# Altium schematic sheet Master_SCH.SchDoc: Блок контроля
size 420 x 297 mm; ApprovedBy: Мешков; CheckedBy: Черноскутов; Author: Самойлов; CompanyName: РГППУ; Title2str: токов; DecimalNumber: АБВГ.123456.001 33
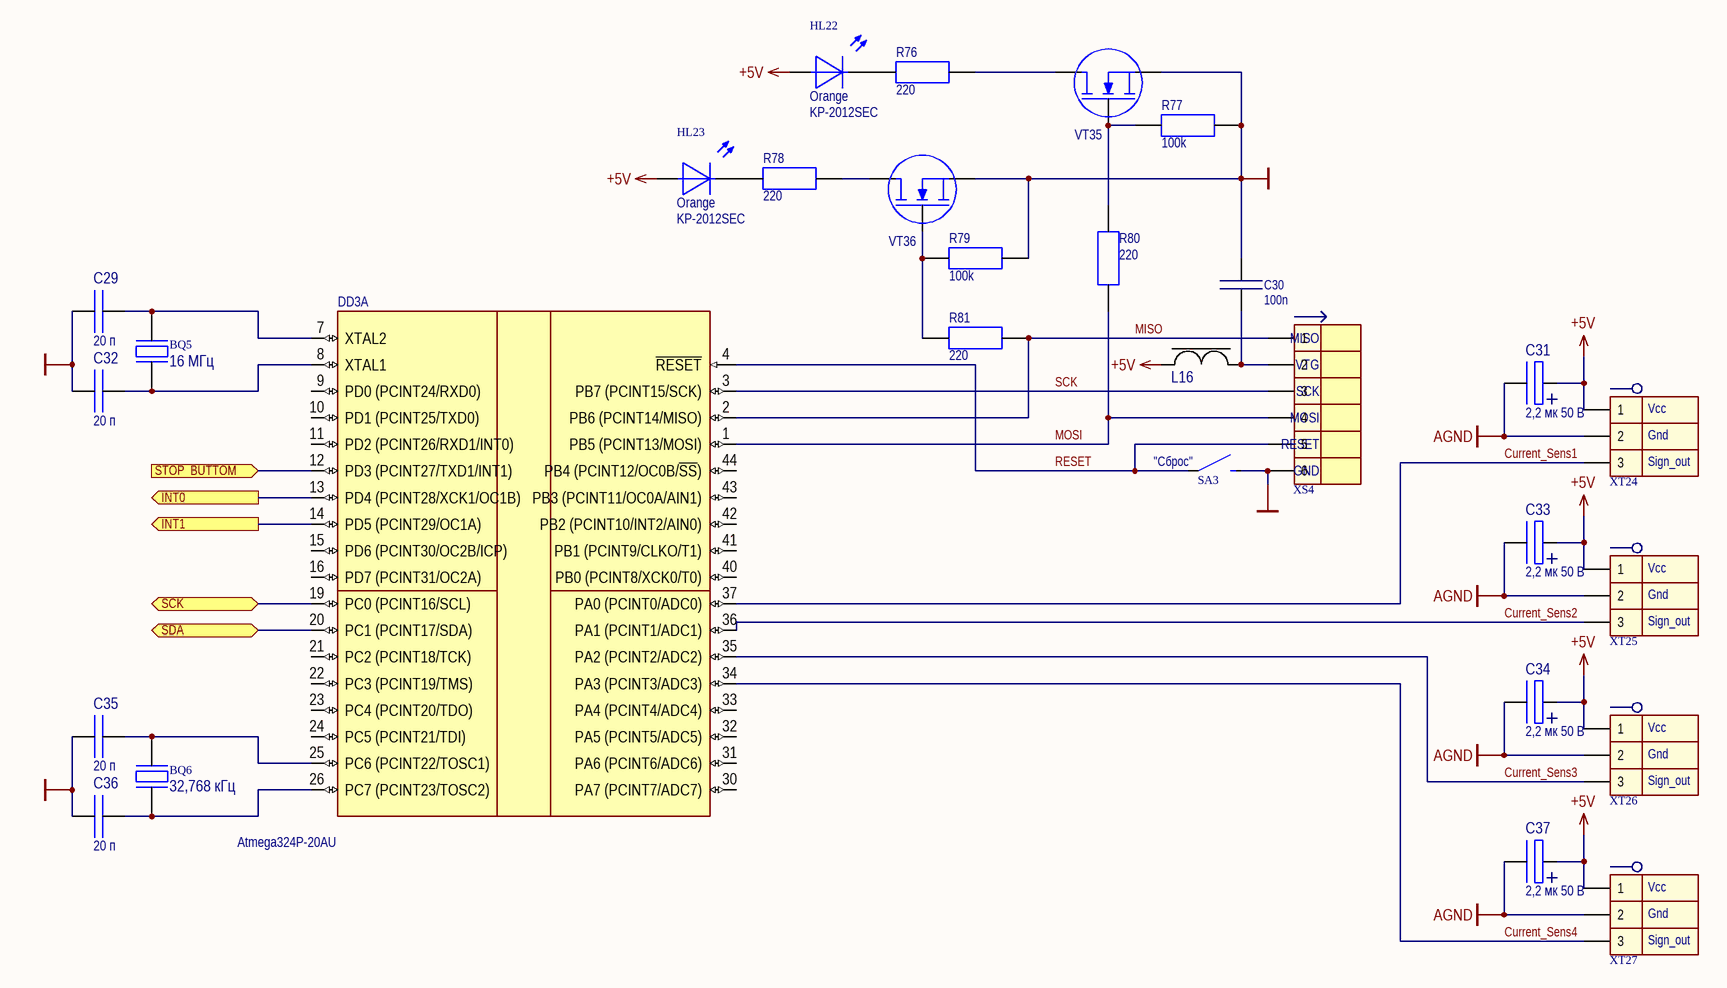
[diagram p0: Master_SCH.SchDoc]

## Parts
BQ5  16 МГц  [HC-49/S]
BQ6  32,768 кГц  [HC-49/S]
C29  value 20 п  [CAPC3216X05M]  (hidden comment: CC0603JRNP09BN200)
C30  100n  [SMDRC0805]
C31  value 2,2 мк 50 В  [CAP_POLAR_ELLYTE_B]  (hidden comment: CA050M2R20REB-0405)
C32  value 20 п  [CAPC3216X05M]  (hidden comment: CC0603JRNP09BN200)
C33  value 2,2 мк 50 В  [CAP_POLAR_ELLYTE_B]  (hidden comment: CA050M2R20REB-0405)
C34  value 2,2 мк 50 В  [CAP_POLAR_ELLYTE_B]  (hidden comment: CA050M2R20REB-0405)
C35  value 20 п  [CAPC3216X05M]  (hidden comment: CC0603JRNP09BN200)
C36  value 20 п  [CAPC3216X05M]  (hidden comment: CC0603JRNP09BN200)
C37  value 2,2 мк 50 В  [CAP_POLAR_ELLYTE_B]  (hidden comment: CA050M2R20REB-0405)
DD3  Atmega324P-20AU  [44ML_M]  (part A of 2)
HL22  Orange  ManufacturerPartNumber: KP-2012SEC  [DIOMELF2012M]
HL23  Orange  ManufacturerPartNumber: KP-2012SEC  [DIOMELF2012M]
L16  MPZ1608S181A  [INDC0603X03M]  (value not drawn)
R76  220  [SMDRC0805]
R77  100k  [SMDRC0805]
R78  220  [SMDRC0805]
R79  100k  [SMDRC0805]
R80  220  [SMDRC0805]
R81  220  [SMDRC0805]
SA3  DTSM20-4.3  [DTSM20]  (value not drawn)
VT35  2N7002  [SOT23 (TO-236AB)]  (value not drawn)
VT36  2N7002  [SOT23 (TO-236AB)]  (value not drawn)
XS4  IDC-06M  [IDC-06M]  (value not drawn)
XT24  330-031-12  [330-031-12]  (value not drawn)
XT25  330-031-12  [330-031-12]  (value not drawn)
XT26  330-031-12  [330-031-12]  (value not drawn)
XT27  330-031-12  [330-031-12]  (value not drawn)

## Ports
INT0 (out), INT1 (out), SCK (bidir), SDA (bidir), STOP_BUTTOM (in)

## Nets
+5V: C31.2(+) C33.2(+) C34.2(+) C37.2(+) HL22.1 HL23.1 L16.1 XT24.1 XT25.1 XT26.1 XT27.1
AGND: C31.1(-) C33.1(-) C34.1(-) C37.1(-) XT24.2 XT25.2 XT26.2 XT27.2
GND: C29.2 C30.2 C32.2 C35.2 C36.2 R77.2 R79.2 SA3.2 VT35.2(S) VT36.2(S) XS4.6
Current_Sens1: DD3.37(PA0_(PCINT0/ADC0)) XT24.3
Current_Sens2: DD3.36(PA1_(PCINT1/ADC1)) XT25.3
Current_Sens3: DD3.35(PA2_(PCINT2/ADC2)) XT26.3
Current_Sens4: DD3.34(PA3_(PCINT3/ADC3)) XT27.3
INT0: DD3.13(PD4_(PCINT28/XCK1/OC1B)) ; port INT0
INT1: DD3.14(PD5_(PCINT29/OC1A)) ; port INT1
MISO: DD3.2(PB6_(PCINT14/MISO)) R81.1 XS4.1
MOSI: DD3.1(PB5_(PCINT13/MOSI)) R80.1 XS4.4
RESET: DD3.4(~{RESET}) SA3.1 XS4.5
SCK: DD3.3(PB7_(PCINT15/SCK)) XS4.3
SCK: DD3.19(PC0_(PCINT16/SCL)) ; port SCK  [a separate net that carries the same name]
SDA: DD3.20(PC1_(PCINT17/SDA)) ; port SDA
STOP_BUTTOM: DD3.12(PD3_(PCINT27/TXD1/INT1)) ; port STOP_BUTTOM
NetBQ5_1: BQ5.1 C32.1 DD3.8(XTAL1)
NetBQ5_2: BQ5.2 C29.1 DD3.7(XTAL2)
NetBQ6_1: BQ6.1 C36.1 DD3.26(PC7_(PCINT23/TOSC2))
NetBQ6_2: BQ6.2 C35.1 DD3.25(PC6_(PCINT22/TOSC1))
NetC30_1: C30.1 L16.2 XS4.2
NetHL22_2: HL22.2 R76.2
NetHL23_2: HL23.2 R78.2
NetR76_1: R76.1 VT35.3(D)
NetR77_1: R77.1 R80.2 VT35.1(G)
NetR78_1: R78.1 VT36.3(D)
NetR79_1: R79.1 R81.2 VT36.1(G)

Not connected (* = marked no-connect by the designer): DD3 9(PD0_(PCINT24/RXD0)) 10(PD1_(PCINT25/TXD0)) 11(PD2_(PCINT26/RXD1/INT0)) 15(PD6_(PCINT30/OC2B/ICP)) 16(PD7_(PCINT31/OC2A)) 21(PC2_(PCINT18/TCK)) 22(PC3_(PCINT19/TMS)) 23(PC4_(PCINT20/TDO)) 24(PC5_(PCINT21/TDI)) 30(PA7_(PCINT7/ADC7)) 31(PA6_(PCINT6/ADC6)) 32(PA5_(PCINT5/ADC5)) 33(PA4_(PCINT4/ADC4)) 40(PB0_(PCINT8/XCK0/T0)) 41(PB1_(PCINT9/CLKO/T1)) 42(PB2_(PCINT10/INT2/AIN0)) 43(PB3_(PCINT11/OC0A/AIN1)) 44(PB4_(PCINT12/OC0B/~{SS}))

## Notes on the sheet
- (near SA3) "Сброс"
- (near XT24) Vcc
- (near XT24) Gnd
- (near XT24) Sign_out
- (near XT25) Vcc
- (near XT25) Gnd
- (near XT25) Sign_out
- (near XT26) Vcc
- (near XT26) Gnd
- (near XT26) Sign_out
- (near XT27) Vcc
- (near XT27) Gnd
- (near XT27) Sign_out
- Изм.
- Лист
- N*докум.
- Подп.
- Дата
- Лит.
- Масса
- Масштаб
- Разраб.
- Пров.
- Т.контр.
- Лиcт
- Лиcтов
- Н.контр.
- Утв.
- (in symbol Con6_M IDC-06M_SPI) MISO; VTG; SCK; MOSI; RESET; GND

## Library data of the parts
BQ5 BQ6 = Piezoelectric_16000: Piezoelectric elements; Manufacturer: Taizhou; ManufacturerPartNumber: 16000 кГц 20ppm 20pF; ComponentLink1URL: http://www.promelec.ru/catalog_info/54/126/246/70/; ComponentLink1Description: Datasheet; Package: HC-49/S; Cost: 8,54; Supplier: Промэлектроника; ComponentLink2Description: Datasheet-local
  BQ5: Value: 16 МГц
  BQ6: Value: 32,768 кГц
C29 C32 C35 C36 = p00020_050: 20pF Bipolar cap; Manufacturer: Yageo; ManufacturerPartNumber: CC0603JRNP09BN200; Supplier: Промэлектроника; Cost: 0,34; Package: 0603; ComponentLink1Description: Datasheet; ComponentLink1URL: http://www.yageo.com/documents/recent/UPY-GPHC_X5R_4V-to-50V_v16.pdf; ComponentLink2Description: Datasheet-local; ComponentLink2URL: *
C30 = Capacitor 0805 100n: Generic capasitor non-polar; PartNumber: Capacitor 0805 100n; Value: 100n; ComponentLink1Description: Datasheet; Package: 0805
C31 C33 C34 C37 = 02200_050: 2,2uF 50V Polar capacitor; Manufacturer: Yageo; ManufacturerPartNumber: CA050M2R20REB-0405; Supplier: Промэлектроника; Cost: 4,11; Package: not standard; ComponentLink1Description: Datasheet; ComponentLink1URL: http://www.yageo.com/documents/recent/E-Cap_SurfaceMount_CA_2011.pdf; ComponentLink2Description: Datasheet-local; ComponentLink2URL: *
DD3 = Atmega324P-20AU: Microcontroller 8-bit; Manufacturer: Atmel; ComponentLink1URL: http://www.atmel.com/Images/Atmel-8011-8-bit-AVR-Microcontroller-ATmega164P-324P-644P_datasheet.pdf; ComponentLink1Description: Datasheet; Cost: 220; Package: TQFP-44; Supplier: Промэлектроника; ManufacturerPartNumber: Atmega324P-20AU
HL22 HL23 = LED1_O: Diod LED SMD Orange; ComponentLink1Description: Datasheet; Cost: 4,91; ComponentLink2Description: Datasheet-local; ComponentLink2URL: *; Color: Orange
L16 = Ferrite Bead: Value: ? мГн; ManufacturerPartNumber: MPZ1608S181A; ComponentLink1Description: Datasheet; Supplier: Промэлектроника; ComponentLink2Description: Datasheet-local; ComponentLink2URL: *
R76 R78 R80 R81 = Resistor 0805 220: Generic resistor; PartNumber: Resistor 0805 220; Value: 220; ComponentLink1URL: http://www.mouser.com/ds/2/447/PYu-RC0402_51_RoHS_L_6_r-8721.pdf; ComponentLink1Description: Datasheet; Package: 0805
R77 R79 = Resistor 0805 100k: Generic resistor; PartNumber: Resistor 0805 100k; Value: 100k; ComponentLink1URL: http://www.mouser.com/ds/2/447/PYu-RC0402_51_RoHS_L_6_r-8721.pdf; ComponentLink1Description: Datasheet; Package: 0805
SA3 = Switch1_DTSM20-4.3: Switch open; Manufacturer: Diptronics; ManufacturerPartNumber: DTSM20-4.3; ComponentLink1Description: Datasheet; ComponentLink1URL: http://www.promelec.ru/catalog/407/1291/1323/1/70721/; ComponentLink2Description: Datasheet-local; ComponentLink2URL: *
VT35 VT36 = 2N7002 n-MOSFET: 60V, 300mA N-channel Trench MOSFET; ManufacturerPartNumber: 2N7002
XS4 = Con6_M IDC-06M_SPI: SPI connector; ManufacturerPartNumber: IDC-06M; ComponentLink1Description: Datasheet; ComponentLink1URL: http://www.promelec.ru/catalog/406/1218/1223/1/156430/; ComponentLink2Description: Datasheet-local; ComponentLink2URL: *
XT24-XT27 = Con3_D 330-031-12: Demountable connection 3-pin; Manufacturer: Degson Electronics Co., Ltd; ManufacturerPartNumber: 330-031-12; ComponentLink1Description: Datasheet; Cost: 13; Supplier: Промэлектроника; ComponentLink2Description: Datasheet-local